# Altium schematic sheet Effect_SCH.SchDoc
size A4
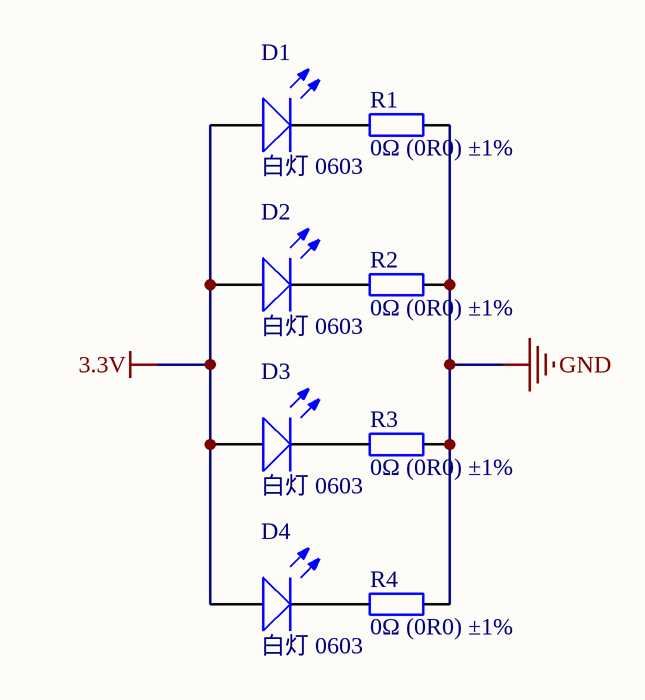
[diagram p0: Effect_SCH.SchDoc]

## Parts
D1  白灯 0603  [0603_LED_S1]
D2  白灯 0603  [0603_LED_S1]
D3  白灯 0603  [0603_LED_S1]
D4  白灯 0603  [0603_LED_S1]
R1  0Ω (0R0) ±1%  [0603_R]
R2  0Ω (0R0) ±1%  [0603_R]
R3  0Ω (0R0) ±1%  [0603_R]
R4  0Ω (0R0) ±1%  [0603_R]

## Nets
3.3V: D1.A D2.A D3.A D4.A
GND: R1.2 R2.2 R3.2 R4.2
NetD1_K: D1.K R1.1
NetD2_K: D2.K R2.1
NetD3_K: D3.K R3.1
NetD4_K: D4.K R4.1

## Library data of the parts
D1-D4 = 0603 白灯: 发光二极管; ComponentLink1Description: 供应商链接; ComponentLink1URL: http://www.szlcsc.com/product/details_2663.html; Package: 0603; Supplier: LC; SuppliersPartNumber: C2290
R1-R4 = 0603 0Ω (0R0) 1%: 贴片电阻; ComponentLink1Description: 供应商链接; ComponentLink1URL: http://www.szlcsc.com/product/details_21903.html; Package: 0603; Supplier: LC; SuppliersPartNumber: C21189